# Altium project TRX-101R19.PrjPcb
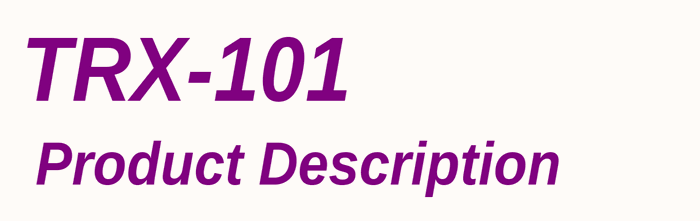
[diagram p0: PG01_Opening Page.SchDoc]
5 sheets, 173 parts. Net scope: global (net labels, ports and power ports of the same name join across sheets).
Board file: TRX-101 Rev19.PcbDoc
Sheets:
  PG01_Opening Page.SchDoc
  PG02_Index and Revs.SchDoc
  PG03_Schematic Sheet1.SchDoc
  PG04_Schematic Sheet2.SchDoc
  PG05_Schematic Sheet3.SchDoc

## Sheet PG01_Opening Page.SchDoc: Opening Page
size B; Date: 2/10/2009; ApprovedBy: Touraj; DrawnBy: Juan A. Nadal; Engineer: Touraj; Organization: ActiveWave; Address1: 902 Clint Moore Rd., Suite 118; Address2: Boca Raton; Address3: FL, 33487; Address4: 561-999-9422; DocumentNumber: 1; Revision: 19; SheetNumber: 1; SheetTotal: 5; PageSetup: Record=PageOptions|CenterHorizontal=True|CenterVertical=True|PrintScale=0.68|XCorrection=1.00|YCorrection=1.00|PrintKind=0|BorderSize=5000000|LeftOffset=0|BottomOffset=0|Orientation=2|PaperLength=1000|PaperWidth=1000|Scale=100|PaperSource=7|PrintQuality=-4|MediaType=1|DitherType=10|PaperKind=Letter (8.5 x 11 in.)|PrintScaleMode=1; Project: TRX-101

### Notes on the sheet
- TRX-101
- Product Description
- APPROVALS
- DATE
- Title:
- Drawn:
- Checked:
- Release:
- Date:
- Size:
- Sheet Name:
- B
- Number:
- Time:
- Revision:
- Sheet
- of
- File:

## Sheet PG02_Index and Revs.SchDoc: Index and Revisions
size B; Date: 2/10/2009; ApprovedBy: Touraj; DrawnBy: Juan A. Nadal; Engineer: Touraj; Organization: ActiveWave; Address1: 902 Clint Moore Rd., Suite 118; Address2: Boca Raton; Address3: FL, 33487; Address4: 561-999-9422; DocumentNumber: 2; Revision: 19; SheetNumber: 2; SheetTotal: 5; PageSetup: Record=PageOptions|CenterHorizontal=True|CenterVertical=True|PrintScale=0.68|XCorrection=1.00|YCorrection=1.00|PrintKind=0|BorderSize=5000000|LeftOffset=0|BottomOffset=0|Orientation=2|PaperLength=1000|PaperWidth=1000|Scale=100|PaperSource=7|PrintQuality=-4|MediaType=1|DitherType=10|PaperKind=Letter|PrintScaleMode=1; Project: TRX-101
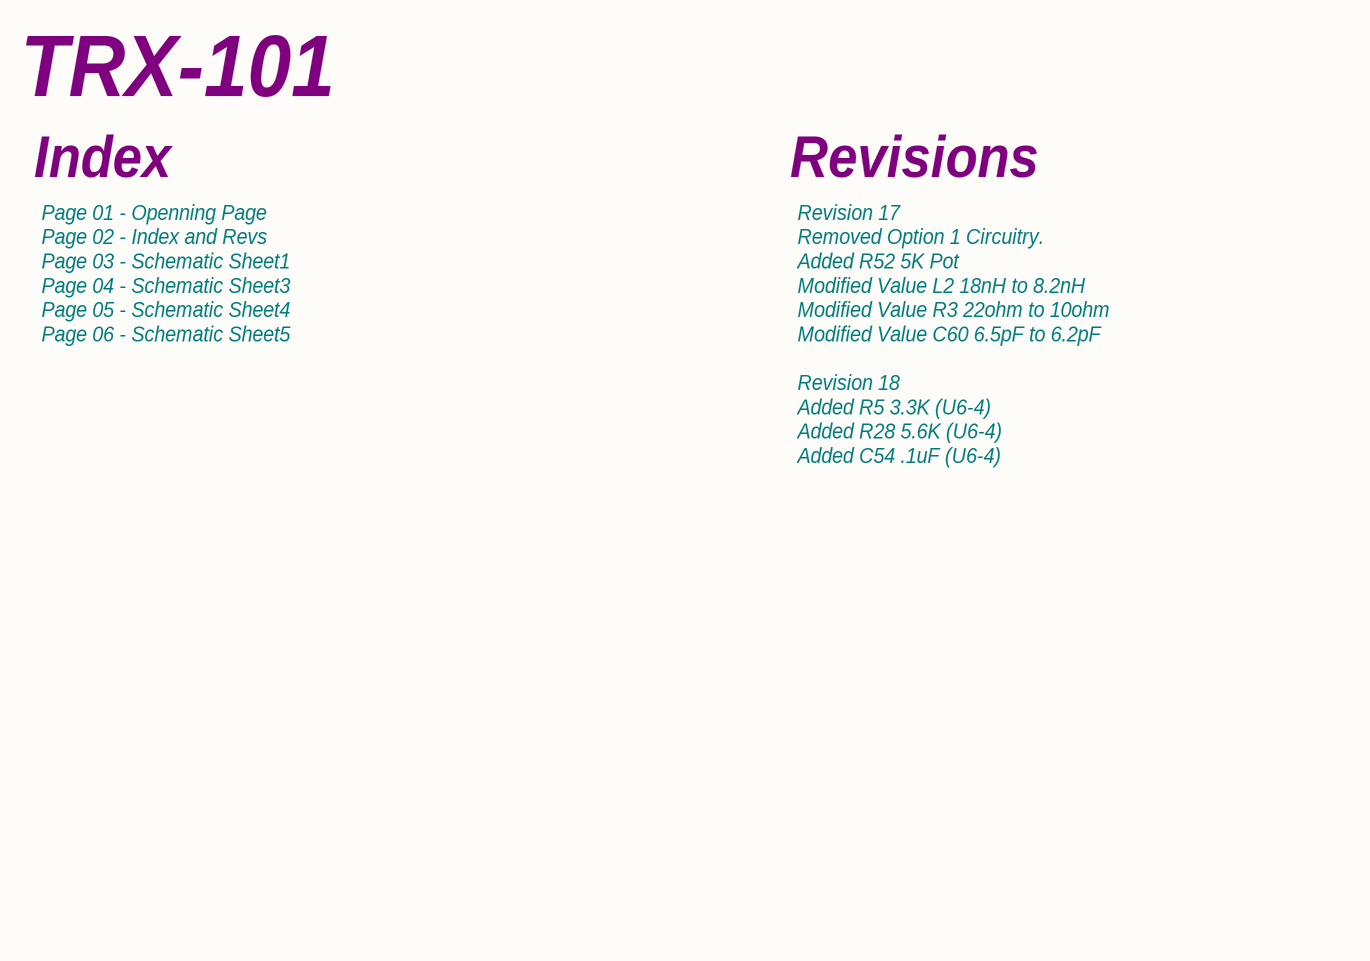
[diagram p1: PG02_Index and Revs.SchDoc]

### Notes on the sheet
- TRX-101
- Index
- Revisions
- Page 01 - Openning Page
  Page 02 - Index and Revs
  Page 03 - Schematic Sheet1
  Page 04 - Schematic Sheet3
  Page 05 - Schematic Sheet4
  Page 06 - Schematic Sheet5
- Revision 17
  Removed Option 1 Circuitry.
  Added R52 5K Pot
  Modified Value L2 18nH to 8.2nH
  Modified Value R3 22ohm to 10ohm
  Modified Value C60 6.5pF to 6.2pF
  Revision 18
  Added R5 3.3K (U6-4)
  Added R28 5.6K (U6-4)
  Added C54 .1uF (U6-4)
- APPROVALS
- DATE
- Title:
- Drawn:
- Checked:
- Release:
- Date:
- Size:
- Sheet Name:
- B
- Number:
- Time:
- Revision:
- Sheet
- of
- File:

## Sheet PG03_Schematic Sheet1.SchDoc: Schematic Sheet 1
size B; Date: 2/10/2009; ApprovedBy: Touraj; DrawnBy: Juan A. Nadal; Engineer: Touraj; Organization: ActiveWave; Address1: 902 Clint Moore Rd., Suite 118; Address2: Boca Raton; Address3: FL, 33487; Address4: 561-999-9422; DocumentNumber: 3; Revision: 19; SheetNumber: 3; SheetTotal: 5; PageSetup: Record=PageOptions|CenterHorizontal=True|CenterVertical=True|PrintScale=0.70|XCorrection=1.00|YCorrection=1.00|PrintKind=0|BorderSize=5000000|LeftOffset=0|BottomOffset=0|Orientation=2|PaperLength=1000|PaperWidth=1000|Scale=100|PaperSource=7|PrintQuality=-4|MediaType=1|DitherType=10|PaperKind=Letter|PrintScaleMode=1; Project: TRX-101
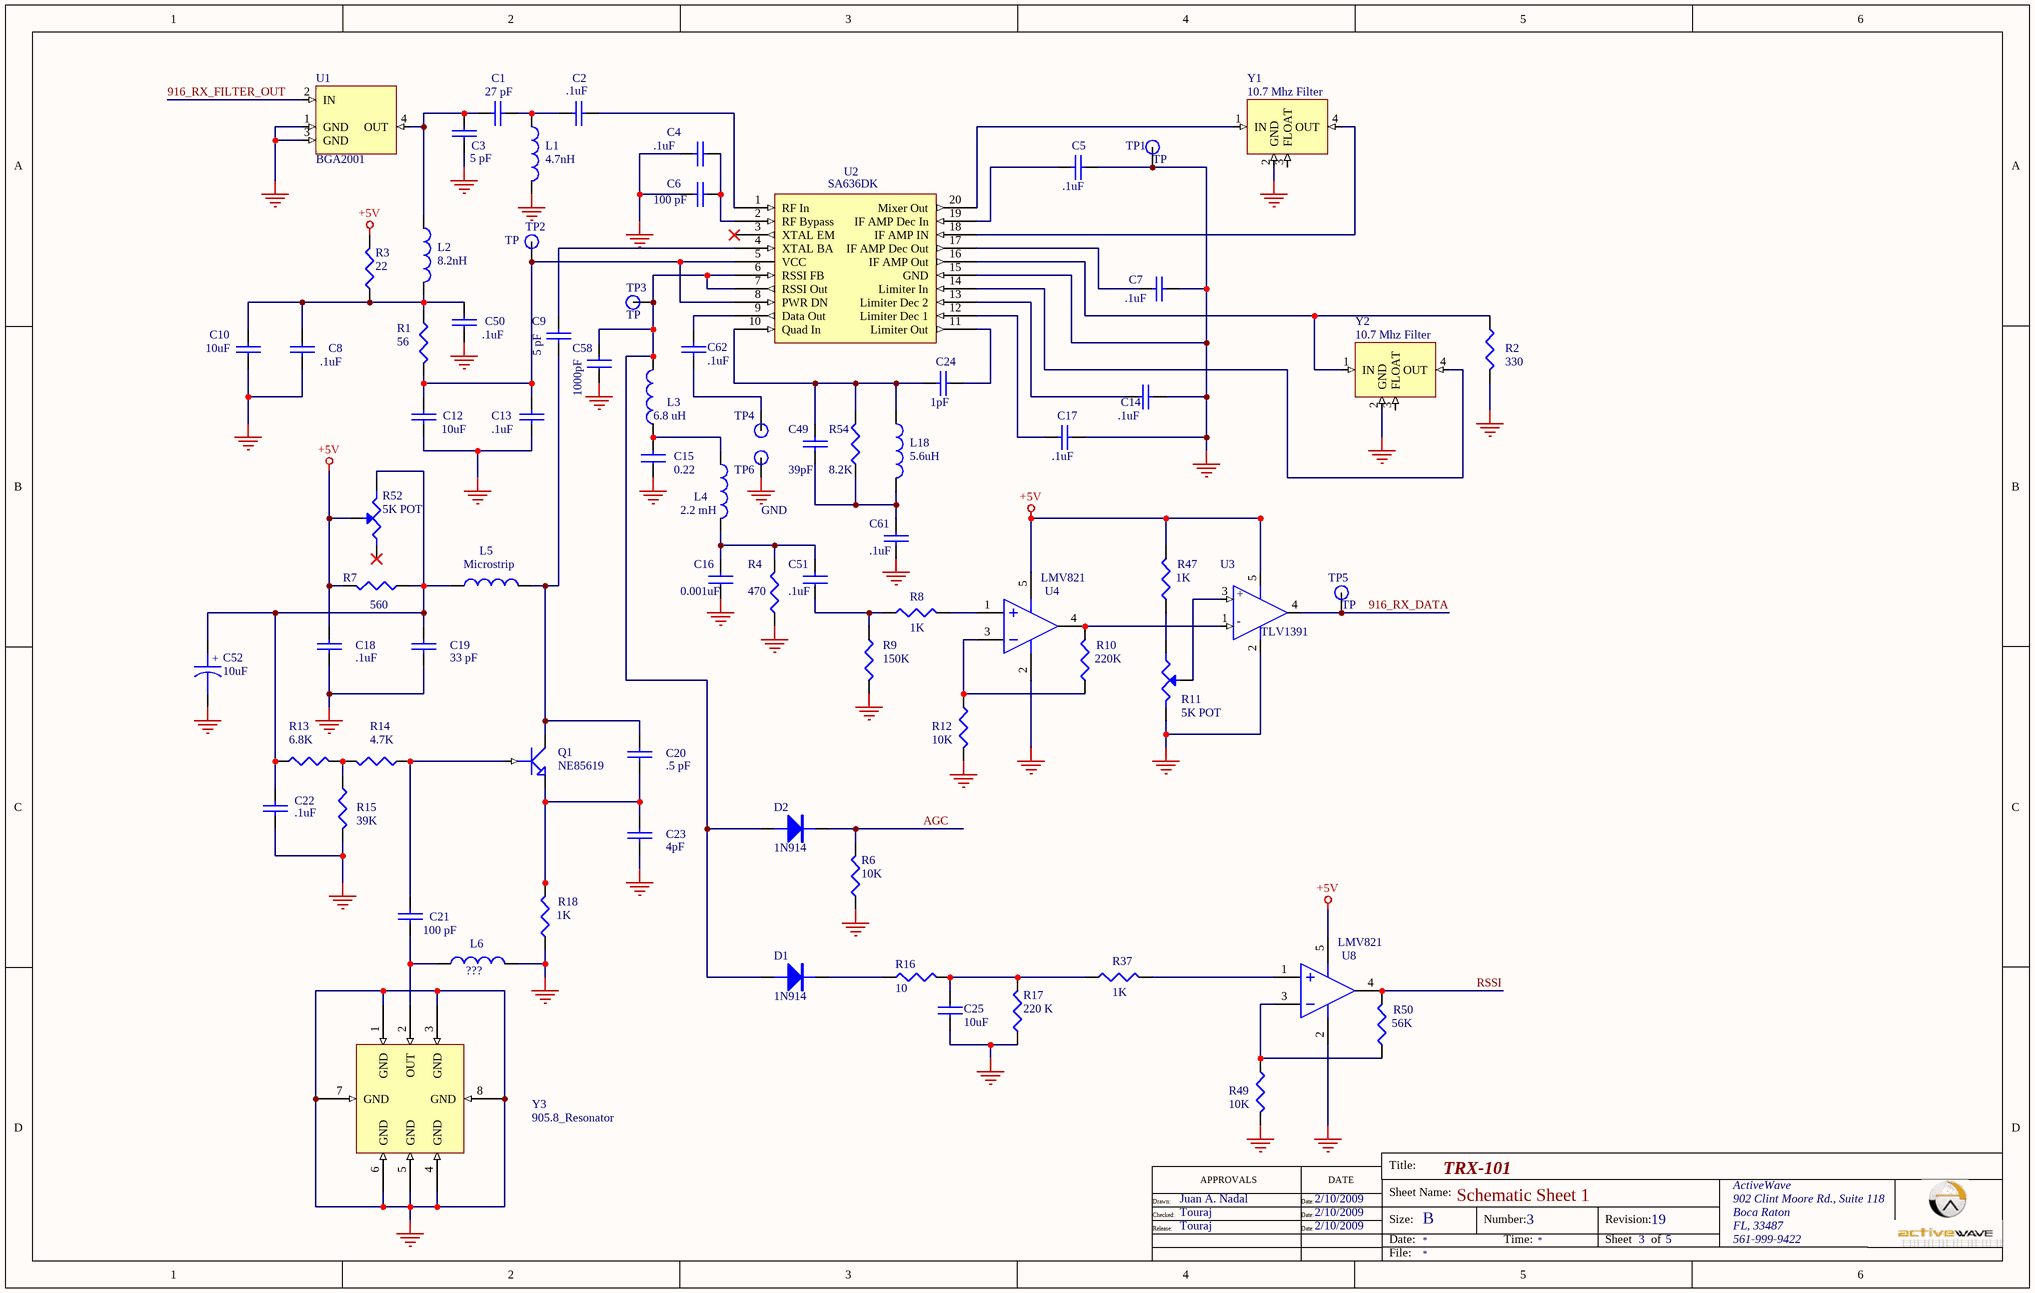
[diagram p2: PG03_Schematic Sheet1.SchDoc]

### Parts
C1  27 pF  [0603]
C2  .1uF  [0603]
C3  5 pF  [0603]
C4  .1uF  [0603]
C5  .1uF  [0603]
C6  100 pF  [0603]
C7  .1uF  [0603]
C8  .1uF  [0603]
C9  5 pF  [0603]
C10  10uF  [CAP A CASE]
C12  10uF  [CAP A CASE]
C13  .1uF  [0603]
C14  .1uF  [0603]
C15  0.22  [0603]
C16  0.001uF  [0603]
C17  .1uF  [0603]
C18  .1uF  [0603]
C19  33 pF  [0603]
C20  .5 pF  [0603]
C21  100 pF  [0603]
C22  .1uF  [0603]
C23  4pF  [0603]
C24  1pF  [0603]
C25  10uF  [CAP A CASE]
C49  39pF  [0603]
C50  .1uF  [0603]
C51  .1uF  [0603]
C52  10uF  [CAP A CASE]
C58  1000pF  [0603]
C61  .1uF  [0603]
C62  .1uF  [0603]
D1  1N914  [SOT23 DIODE]
D2  1N914  [SOT23 DIODE]
L1  4.7nH  [0603]
L2  8.2nH  [0603]
L3  6.8 uH  [0805]
L4  2.2 mH  [COIL TKS5540CT-ND]
L5  Microstrip  [MICROSTRIP]
L6  ???  [0603]
L18  5.6uH  [0603]
Q1  NE85619  [3 PIN ULTRA SUPER MINI MOLD]
R1  56  [0603]
R2  330  [0603]
R3  22  [0603]
R4  470  [0603]
R6  10K  [0603]
R7  560  [0603]
R8  1K  [0603]
R9  150K  [0603]
R10  220K  [0603]
R11  5K POT  [POT PANA EVN5]
R12  10K  [0603]
R13  6.8K  [0603]
R14  4.7K  [0603]
R15  39K  [0603]
R16  10  [0603]
R17  220 K  [0603]
R18  1K  [0603]
R37  1K  [0603]
R47  1K  [0603]
R49  10K  [0603]
R50  56K  [0603]
R52  5K POT  [POT PANA EVN5]
R54  8.2K  [0603]
TP1  TP  [TESTPOINT]
TP2  TP  [TESTPOINT]
TP3  TP  [TESTPOINT]
TP4  TP  [TESTPOINT]  (value not drawn)
TP5  TP  [TESTPOINT]
TP6  GND  [TESTPOINT]
U1  BGA2001  [SOT343]
U2  SA636DK  [SSOP20]
U3  TLV1391  [SOT25]
U4  LMV821  [SOT25]
U8  LMV821  [SOT25]
Y1  10.7 Mhz Filter  [FILTER2]
Y2  10.7 Mhz Filter  [FILTER2]
Y3  905.8_Resonator  [RESONATOR]

### Nets
+5V: C18.1 R3.2 R7.2 R47.2 R52.2 U3.5(VDD) U4.5 U8.5
GND_SIGNAL: C3.2 C4.1 C5.2 C6.1 C7.2 C8.2 C10.2 C12.2 C13.2 C14.2 C15.1 C16.1 C17.2 C18.2 C19.2 C22.2 C23.2 C25.2 C50.2 C52.2 C58.1 C61.2 L1.2 L6.2 R2.2 R4.1 R6.2 R9.2 R11.3 R12.2 R15.2 R17.2 R18.1 R49.2 TP1.1(TP) TP6.1(TP) U1.1(GND) U1.3(GND) U2.15(GND) U3.2(VSS) U4.2 U8.2 Y1.2(GND) Y2.2(GND) Y3.1(GND) Y3.3(GND) Y3.4(GND) Y3.5(GND) Y3.6(GND) Y3.7(GND) Y3.8(GND)
916_RX_DATA: TP5.1(TP) U3.4(OUT)
916_RX_FILTER_OUT: U1.2(IN)
AGC: D2.K R6.1
RSSI: R50.2 U8.4
NetC1_1: C1.1 C3.1 L2.1 U1.4(OUT)
NetC1_2: C1.2 C2.1 L1.1
NetC2_2: C2.2 U2.1(RF_In)
NetC4_2: C4.2 C6.2 U2.2(RF_Bypass)
NetC5_1: C5.1 U2.19(IF_AMP_Dec_In)
NetC7_1: C7.1 U2.17(IF_AMP_Dec_Out)
NetC8_1: C8.1 C10.1 C50.1 L2.2 R1.1 R3.1
NetC9_1: C9.1 C20.1 L5.2 Q1.C
NetC9_2: C9.2 U2.4(XTAL_BA)
NetC12_1: C12.1 C13.1 R1.2 TP2.1(TP) U2.5(VCC) U2.8(PWR_DN)
NetC14_1: C14.1 U2.13(Limiter_Dec_2)
NetC15_2: C15.2 L3.1 L4.1
NetC16_2: C16.2 C51.2 L4.2 R4.2
NetC17_1: C17.1 U2.12(Limiter_Dec_1)
NetC19_1: C19.1 C22.1 C52.1 L5.1 R7.1 R13.1 R52.1
NetC20_2: C20.2 C23.1 Q1.E R18.2
NetC21_1: C21.1 Q1.B R14.1
NetC21_2: C21.2 L6.1 Y3.2(OUT)
NetC24_1: C24.1 C49.1 L18.1 R54.2 U2.10(Quad_In)
NetC24_2: C24.2 U2.11(Limiter_Out)
NetC25_1: C25.1 R16.1 R17.1 R37.1
NetC49_2: C49.2 C61.1 L18.2 R54.1
NetC51_1: C51.1 R8.1 R9.1
NetC58_2: C58.2 D1.A D2.A L3.2 TP3.1(TP) U2.6(RSSI_FB) U2.7(RSSI_Out)
NetC62_1: C62.1 TP4.1(TP)
NetC62_2: C62.2 U2.9(Data_Out)
NetD1_K: D1.K R16.2
NetR2_1: R2.1 U2.16(IF_AMP_Out) Y2.1(IN)
NetR8_2: R8.2 U4.1
NetR10_1: R10.1 R12.1 U4.3
NetR10_2: R10.2 U3.1(-) U4.4
NetR11_1: R11.1 R47.1
NetR11_2: R11.2 U3.3(+)
NetR13_2: R13.2 R14.2 R15.1
NetR37_2: R37.2 U8.1
NetR49_1: R49.1 R50.1 U8.3
NetU2_14: U2.14(Limiter_In) Y2.4(OUT)
NetU2_18: U2.18(IF_AMP_IN) Y1.4(OUT)
NetU2_20: U2.20(Mixer_Out) Y1.1(IN)

Not connected (* = marked no-connect by the designer): R52 3*; U2 3(XTAL_EM)*; Y1 3(FLOAT); Y2 3(FLOAT)

### Notes on the sheet
- APPROVALS
- DATE
- Title:
- Drawn:
- Checked:
- Release:
- Date:
- Size:
- Sheet Name:
- B
- Number:
- Time:
- Revision:
- Sheet
- of
- File:
- (in symbol CAPACITOR POL) +

### Library data of the parts
C1-C10 C12-C14 C17-C24 C49 C50 C61 C62 = CAP: Capacitor
C15 C16 C25 C51 C58 = CAP_NP: Text Field1: 20; Text Field2: 10
C52 = CAPACITOR POL: Capacitor
D1 D2 = DIODE
L1-L6 L18 = INDUCTOR: Text Field1: 20; Text Field2: 40
Q1 = NPN1: NPN Transistor
R1-R4 R6 R8-R10 R12 R16 R17 R37 R47 R49 R50 R54 = R: Text Field1: 20; Text Field2: 30
R7 R13-R15 R18 = RESISTOR: Text Field1: 20; Text Field2: 30
R11 R52 = POT1: Potentiometer
TP6 = TP
U2 = SA636DK: Text Field1: 120; Text Field2: 110
U3 = TLV1391: Text Field1: 40; Text Field2: 40
U4 U8 = OPAMP1
Y1 Y2 = FILTER2
Y3 = RESONATOR2

## Sheet PG04_Schematic Sheet2.SchDoc: Schematic Sheet 2
size B; Date: 2/10/2009; ApprovedBy: Touraj; DrawnBy: Juan A. Nadal; Engineer: Touraj; Organization: ActiveWave; Address1: 902 Clint Moore Rd., Suite 118; Address2: Boca Raton; Address3: FL, 33487; Address4: 561-999-9422; DocumentNumber: 4; Revision: 19; SheetNumber: 4; SheetTotal: 5; PageSetup: Record=PageOptions|CenterHorizontal=True|CenterVertical=True|PrintScale=0.70|XCorrection=1.00|YCorrection=1.00|PrintKind=0|BorderSize=5000000|LeftOffset=0|BottomOffset=0|Orientation=2|PaperLength=1000|PaperWidth=1000|Scale=100|PaperSource=7|PrintQuality=-4|MediaType=1|DitherType=10|PaperKind=Letter|PrintScaleMode=1; Project: TRX-101
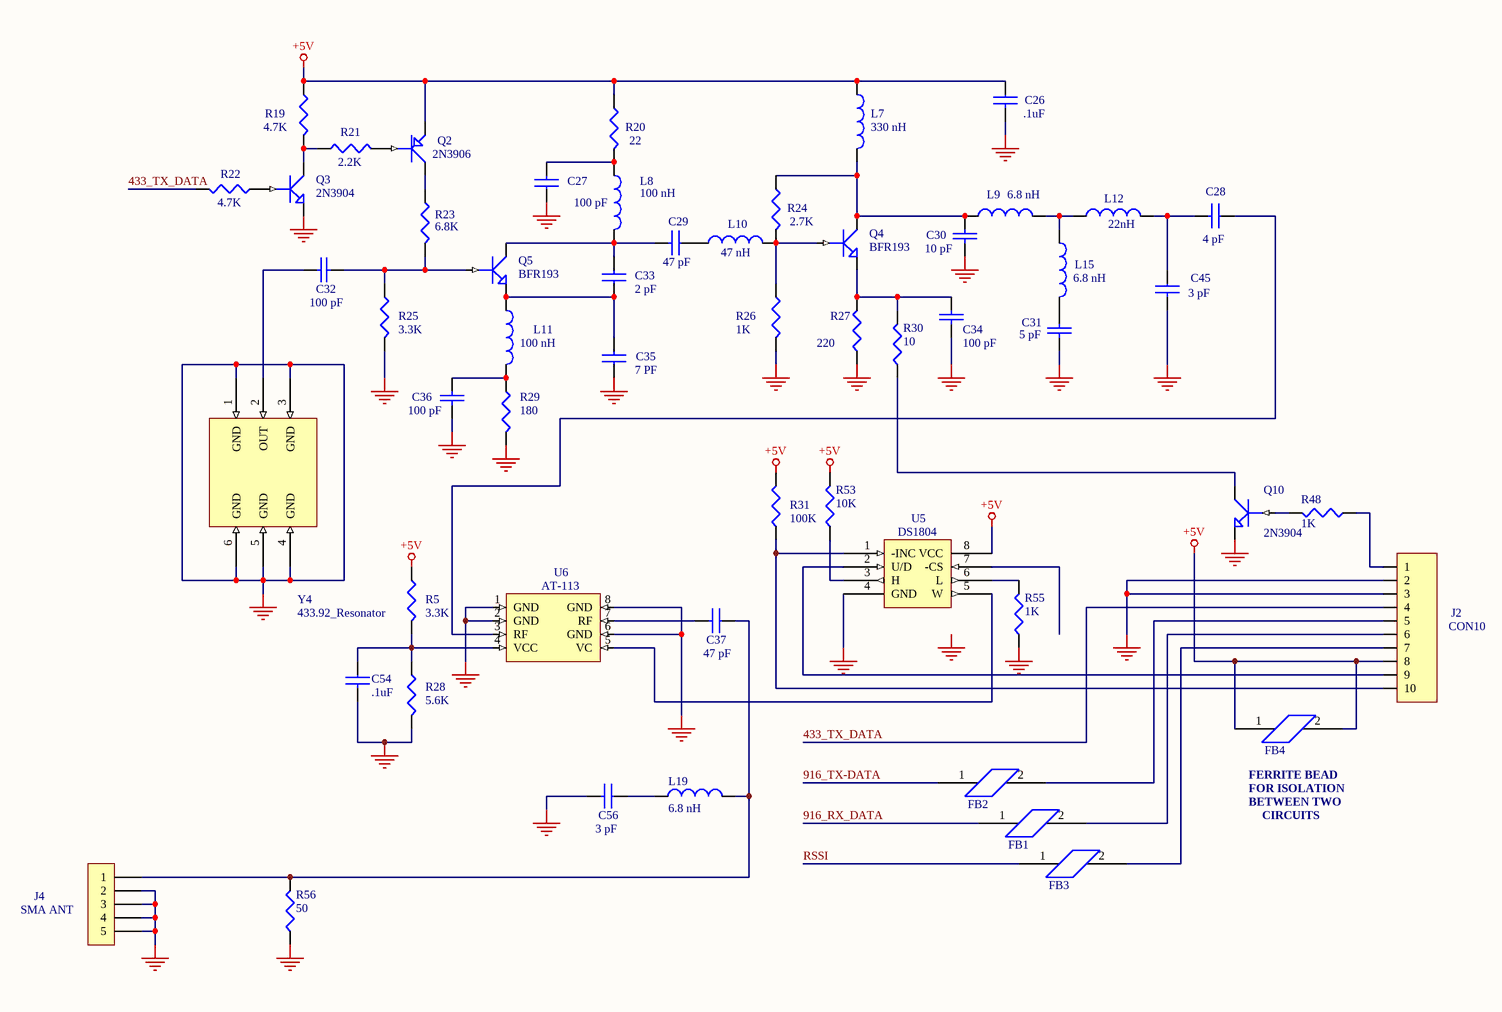
[diagram p3: PG04_Schematic Sheet2.SchDoc]

### Parts
C26  .1uF  [0603]
C27  100 pF  [0603]
C28  4 pF  [0603]
C29  47 pF  [0603]
C30  10 pF  [0603]
C31  5 pF  [0603]
C32  100 pF  [0603]
C33  2 pF  [0603]
C34  100 pF  [0603]
C35  7 PF  [0603]
C36  100 pF  [0603]
C37  47 pF  [0603]
C45  3 pF  [0603]
C54  .1uF  [0603]
C56  3 pF  [0603]
FB1  FB  [0603]  (value not drawn)
FB2  FB  [0603]  (value not drawn)
FB3  FB  [0603]  (value not drawn)
FB4  FB  [0603]  (value not drawn)
J2  CON10  [1X10 HEADER]
J4  SMA ANT  [50 OHM ANT]
L7  330 nH  [0805]
L8  100 nH  [0603]
L9  6.8 nH  [0603]
L10  47 nH  [0603]
L11  100 nH  [0603]
L12  22nH  [0603]
L15  6.8 nH  [0603]
L19  6.8 nH  [0603]
Q2  2N3906  [SOT23 TRANS]
Q3  2N3904  [SOT23 TRANS]
Q4  BFR193  [SOT23 TRANS]
Q5  BFR193  [SOT23 TRANS]
Q10  2N3904  [SOT23 TRANS]
R5  3.3K  [0603]
R19  4.7K  [0603]
R20  22  [0603]
R21  2.2K  [0603]
R22  4.7K  [0603]
R23  6.8K  [0603]
R24  2.7K  [0603]
R25  3.3K  [0603]
R26  1K  [0603]
R27  220  [0603]
R28  5.6K  [0603]
R29  180  [0603]
R30  10  [0603]
R31  100K  [0603]
R48  1K  [0603]
R53  10K  [0603]
R55  1K  [0603]
R56  50  [0603]
U5  DS1804  [SO8 SMALL]
U6  AT-113  [SO8]
Y4  433.92_Resonator  [RESONATOR2]

### Nets
+5V: C26.1 FB4.1 FB4.2 J2.8 L7.1 Q2.E R5.1 R19.1 R20.1 R31.1 R53.2 U5.8(VCC)
GND_SIGNAL: C26.2 C27.1 C30.2 C31.2 C34.2 C35.1 C36.2 C45.2 C54.2 C56.2 J2.2 J2.3 J4.2 J4.3 J4.4 J4.5 Q3.E Q10.E R25.2 R26.2 R27.2 R28.2 R29.2 R55.1 R56.1 U5.4(GND) U6.1(GND) U6.2(GND) U6.6(GND) U6.8(GND) Y4.1(GND) Y4.3(GND) Y4.4(GND) Y4.5(GND) Y4.6(GND)
433_TX_DATA: J2.4 R22.2
916_RX_DATA: FB1.1
916_TX-DATA: FB2.1
RSSI: FB3.1
NetC27_2: C27.2 L8.1 R20.2
NetC28_1: C28.1 U6.3(RF)
NetC28_2: C28.2 C45.1 L12.2
NetC29_1: C29.1 L10.1
NetC29_2: C29.2 C33.2 L8.2 Q5.C
NetC30_1: C30.1 L7.2 L9.1 Q4.C R24.1
NetC31_1: C31.1 L15.2
NetC32_1: C32.1 Y4.2(OUT)
NetC32_2: C32.2 Q5.B R23.2 R25.1
NetC33_1: C33.1 C35.2 L11.1 Q5.E
NetC34_1: C34.1 Q4.E R27.1 R30.2
NetC36_1: C36.1 L11.2 R29.1
NetC37_1: C37.1 J4.1 L19.2 R56.2
NetC37_2: C37.2 U6.7(RF)
NetC54_1: C54.1 R5.2 R28.1 U6.4(VCC)
NetC56_1: C56.1 L19.1
NetFB1_2: FB1.2 J2.6
NetFB2_2: FB2.2 J2.5
NetFB3_2: FB3.2 J2.7
NetJ2_1: J2.1 R48.2
NetJ2_9: J2.9 U5.2(U/D)
NetJ2_10: J2.10 R31.2 U5.1(-INC)
NetL9_2: L9.2 L12.1 L15.1
NetL10_2: L10.2 Q4.B R24.2 R26.1
NetQ2_B: Q2.B R21.2
NetQ2_C: Q2.C R23.1
NetQ3_B: Q3.B R22.1
NetQ3_C: Q3.C R19.2 R21.1
NetQ10_B: Q10.B R48.1
NetQ10_C: Q10.C R30.1
NetR53_1: R53.1 U5.3(H)
NetR55_2: R55.2 U5.6(L)
NetU5_5: U5.5(W) U6.5(VC)

Not connected (* = marked no-connect by the designer): U5 7(-CS)

### Notes on the sheet
- (near FB4) FERRITE BEAD
- FOR ISOLATION
- BETWEEN TWO
- CIRCUITS
- Labels drawn without touching a wire or pin: GND_SIGNAL
- APPROVALS
- DATE
- Title:
- Drawn:
- Checked:
- Release:
- Date:
- Size:
- Sheet Name:
- B
- Number:
- Time:
- Revision:
- Sheet
- of
- File:

### Library data of the parts
C26-C29 C33 C35 C37 C45 C54 C56 = CAP_NP: Text Field1: 20; Text Field2: 10
C30-C32 C34 C36 = CAP: Capacitor
FB1-FB4 = FB_0603: Part Field 1: Part Number EXC-ML16A270U; Part Field 2: Vendor Panasonic - ECG; Part Field 3: Description BEAD CORE 27 OHM 4A 0603 SMD
J2 = CON10: Text Field1: 30; Text Field2: 110
J4 = CON5: Connector
L7-L12 L15 L19 = INDUCTOR: Text Field1: 20; Text Field2: 40
Q2 = PNP1: PNP Transistor
Q3-Q5 Q10 = NPN1: NPN Transistor
R5 R19-R31 R48 R53 R55 R56 = RESISTOR: Text Field1: 20; Text Field2: 30
U5 = DS1804: Text Field1: 50; Text Field2: 50
U6 = AT-113A
Y4 = RESONATOR2

## Sheet PG05_Schematic Sheet3.SchDoc: Schematic Sheet 3
size B; Date: 2/10/2009; ApprovedBy: Touraj; DrawnBy: Juan A. Nadal; Engineer: Touraj; Organization: ActiveWave; Address1: 902 Clint Moore Rd., Suite 118; Address2: Boca Raton; Address3: FL, 33487; Address4: 561-999-9422; DocumentNumber: 5; Revision: 19; SheetNumber: 5; SheetTotal: 5; PageSetup: Record=PageOptions|CenterHorizontal=True|CenterVertical=True|PrintScale=0.70|XCorrection=1.00|YCorrection=1.00|PrintKind=0|BorderSize=5000000|LeftOffset=0|BottomOffset=0|Orientation=2|PaperLength=1000|PaperWidth=1000|Scale=100|PaperSource=7|PrintQuality=-4|MediaType=1|DitherType=10|PaperKind=Letter|PrintScaleMode=1; Project: TRX-101
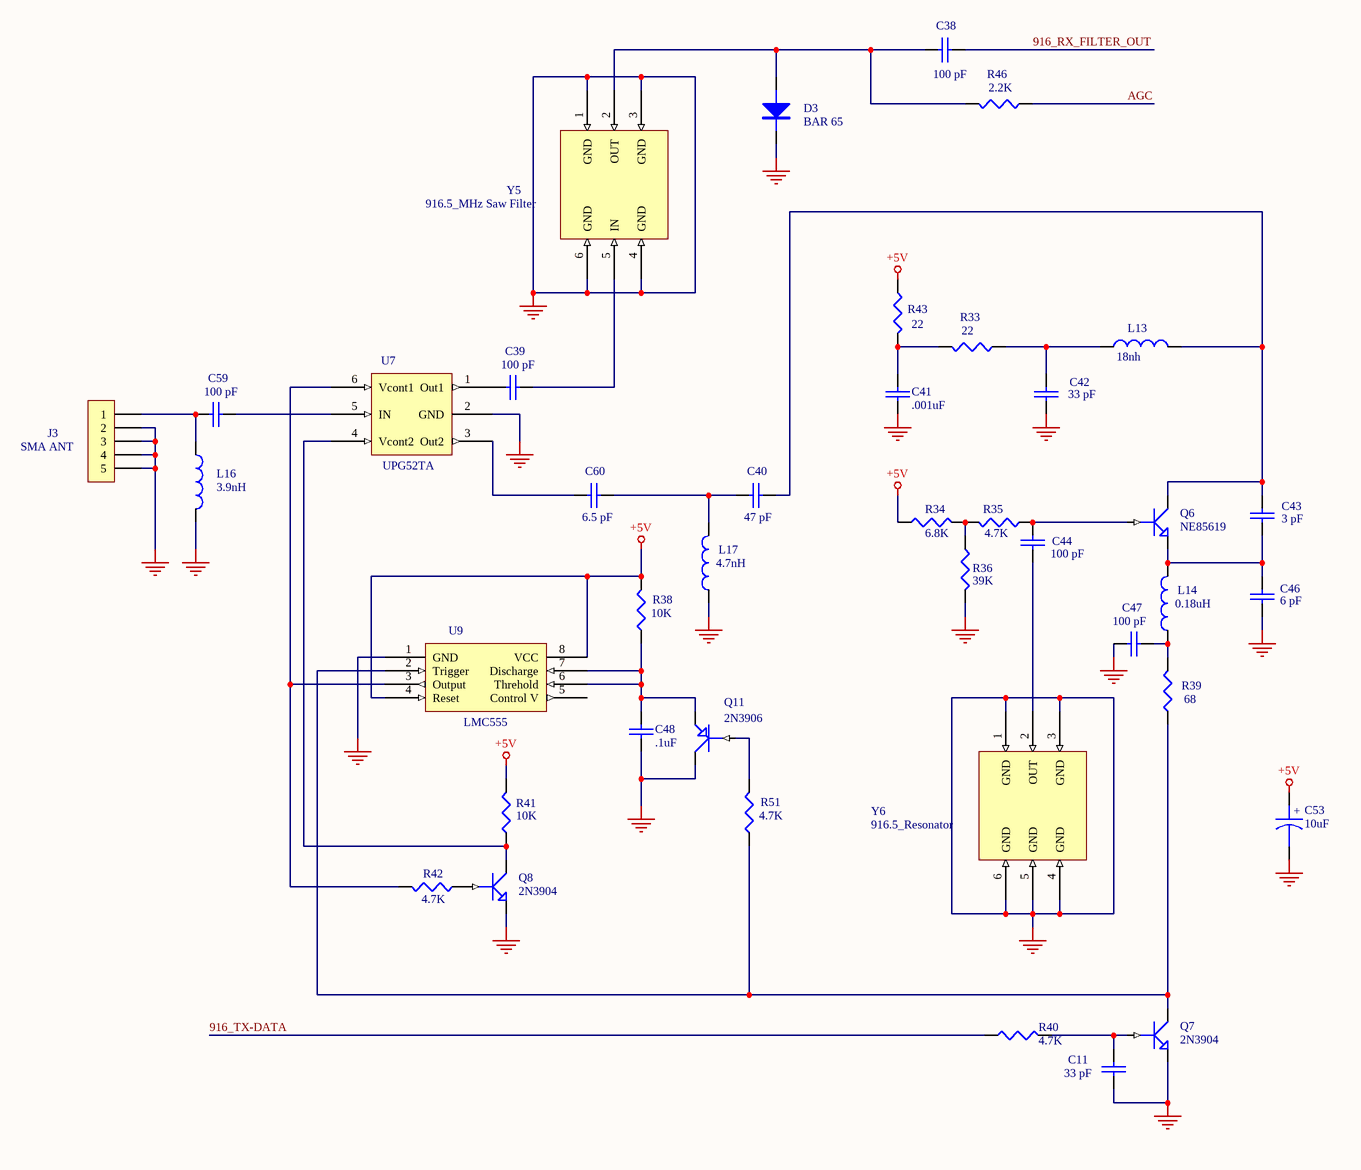
[diagram p4: PG05_Schematic Sheet3.SchDoc]

### Parts
C11  33 pF  [0603]
C38  100 pF  [0603]
C39  100 pF  [0603]
C40  47 pF  [0603]
C41  .001uF  [0603]
C42  33 pF  [0603]
C43  3 pF  [0603]
C44  100 pF  [0603]
C46  6 pF  [0603]
C47  100 pF  [0603]
C48  .1uF  [0603]
C53  10uF  [CAP A CASE]
C59  100 pF  [0603]
C60  6.5 pF  [0603]
D3  BAR 65  [DIODE SC79]
J3  SMA ANT  [50 OHM ANT]
L13  18nh  [0603]
L14  0.18uH  [0603]
L16  3.9nH  [0603]
L17  4.7nH  [0603]
Q6  NE85619  [3 PIN ULTRA SUPER MINI MOLD]
Q7  2N3904  [SOT23 TRANS]
Q8  2N3904  [SOT23 TRANS]
Q11  2N3906  [SOT23 TRANS]
R33  22  [0603]
R34  6.8K  [0603]
R35  4.7K  [0603]
R36  39K  [0603]
R38  10K  [0603]
R39  68  [0603]
R40  4.7K  [0603]
R41  10K  [0603]
R42  4.7K  [0603]
R43  22  [0603]
R46  2.2K  [0603]
R51  4.7K  [0603]
U7  UPG52TA  [TO6]
U9  LMC555  [SO8 SMALL]
Y5  916.5_MHz Saw Filter
Y6  916.5_Resonator  [RESONATOR2]

### Nets
+5V: C53.1 R34.1 R38.2 R41.2 R43.1 U9.4(Reset) U9.8(VCC)
GND_SIGNAL: C11.2 C41.2 C42.2 C46.2 C47.1 C48.2 C53.2 D3.K J3.2 J3.3 J3.4 J3.5 L16.2 L17.1 Q7.E Q8.E Q11.C R36.2 U7.2(GND) U9.1(GND) Y5.1(GND) Y5.3(GND) Y5.4(GND) Y5.6(GND) Y6.1(GND) Y6.3(GND) Y6.4(GND) Y6.5(GND) Y6.6(GND)
916_RX_FILTER_OUT: C38.2
916_TX-DATA: R40.1
AGC: R46.1
NetC11_1: C11.1 Q7.B R40.2
NetC38_1: C38.1 D3.A R46.2 Y5.2(OUT)
NetC39_1: C39.1 U7.1(Out1)
NetC39_2: C39.2 Y5.5(IN)
NetC40_1: C40.1 C60.2 L17.2
NetC40_2: C40.2 C43.1 L13.2 Q6.C
NetC41_1: C41.1 R33.2 R43.2
NetC42_1: C42.1 L13.1 R33.1
NetC43_2: C43.2 C46.1 L14.2 Q6.E
NetC44_1: C44.1 Q6.B R35.1
NetC44_2: C44.2 Y6.2(OUT)
NetC47_2: C47.2 L14.1 R39.2
NetC48_1: C48.1 Q11.E R38.1 U9.6(Threhold) U9.7(Discharge)
NetC59_1: C59.1 J3.1 L16.1
NetC59_2: C59.2 U7.5(IN)
NetC60_1: C60.1 U7.3(Out2)
NetQ7_C: Q7.C R39.1 R51.1 U9.2(Trigger)
NetQ8_B: Q8.B R42.1
NetQ8_C: Q8.C R41.1 U7.4(Vcont2)
NetQ11_B: Q11.B R51.2
NetR34_2: R34.2 R35.2 R36.1
NetR42_2: R42.2 U7.6(Vcont1) U9.3(Output)

Not connected (* = marked no-connect by the designer): U9 5(Control_V)

### Notes on the sheet
- APPROVALS
- DATE
- Title:
- Drawn:
- Checked:
- Release:
- Date:
- Size:
- Sheet Name:
- B
- Number:
- Time:
- Revision:
- Sheet
- of
- File:
- (in symbol CAPACITOR POL) +

### Library data of the parts
C11 C38-C44 C46-C48 C59 C60 = CAP: Capacitor
C53 = CAPACITOR POL: Capacitor
D3 = DIODE
J3 = CON5: Connector
L13 = INDUCTOR: INDUCTOR 18NH 5% 0603 SMD; VendorPartNumber: PCD1976TR-ND; MFG_PartNumber: ELJ-RE18NJFA; Text Field1: 20; Text Field2: 40; Vendor: DigiKey; MFG: Panasdonic; Value: 18nh
L14 L16 L17 = INDUCTOR: Text Field1: 20; Text Field2: 40
Q6-Q8 = NPN1: NPN Transistor
Q11 = PNP1: PNP Transistor
R33-R36 R38-R43 R46 R51 = RESISTOR: Text Field1: 20; Text Field2: 30
U7 = UPG152TA_0: Text Field1: 60; Text Field2: 60
U9 = LMC555: Text Field1: 90; Text Field2: 50
Y5 = RESONATOR3
Y6 = RESONATOR2

## Nets that join several sheets
+5V: PG03_Schematic Sheet1 (8 pins), PG04_Schematic Sheet2 (12 pins), PG05_Schematic Sheet3 (7 pins)
GND_SIGNAL: PG03_Schematic Sheet1 (51 pins), PG04_Schematic Sheet2 (35 pins), PG05_Schematic Sheet3 (29 pins)
916_RX_DATA: PG03_Schematic Sheet1 (TP5.1 U3.4), PG04_Schematic Sheet2 (FB1.1)
916_RX_FILTER_OUT: PG03_Schematic Sheet1 (U1.2), PG05_Schematic Sheet3 (C38.2)
916_TX-DATA: PG04_Schematic Sheet2 (FB2.1), PG05_Schematic Sheet3 (R40.1)
AGC: PG03_Schematic Sheet1 (D2.K R6.1), PG05_Schematic Sheet3 (R46.1)
RSSI: PG03_Schematic Sheet1 (R50.2 U8.4), PG04_Schematic Sheet2 (FB3.1)